# EAGLE design shadokmotion (EAGLE 9.5.2)
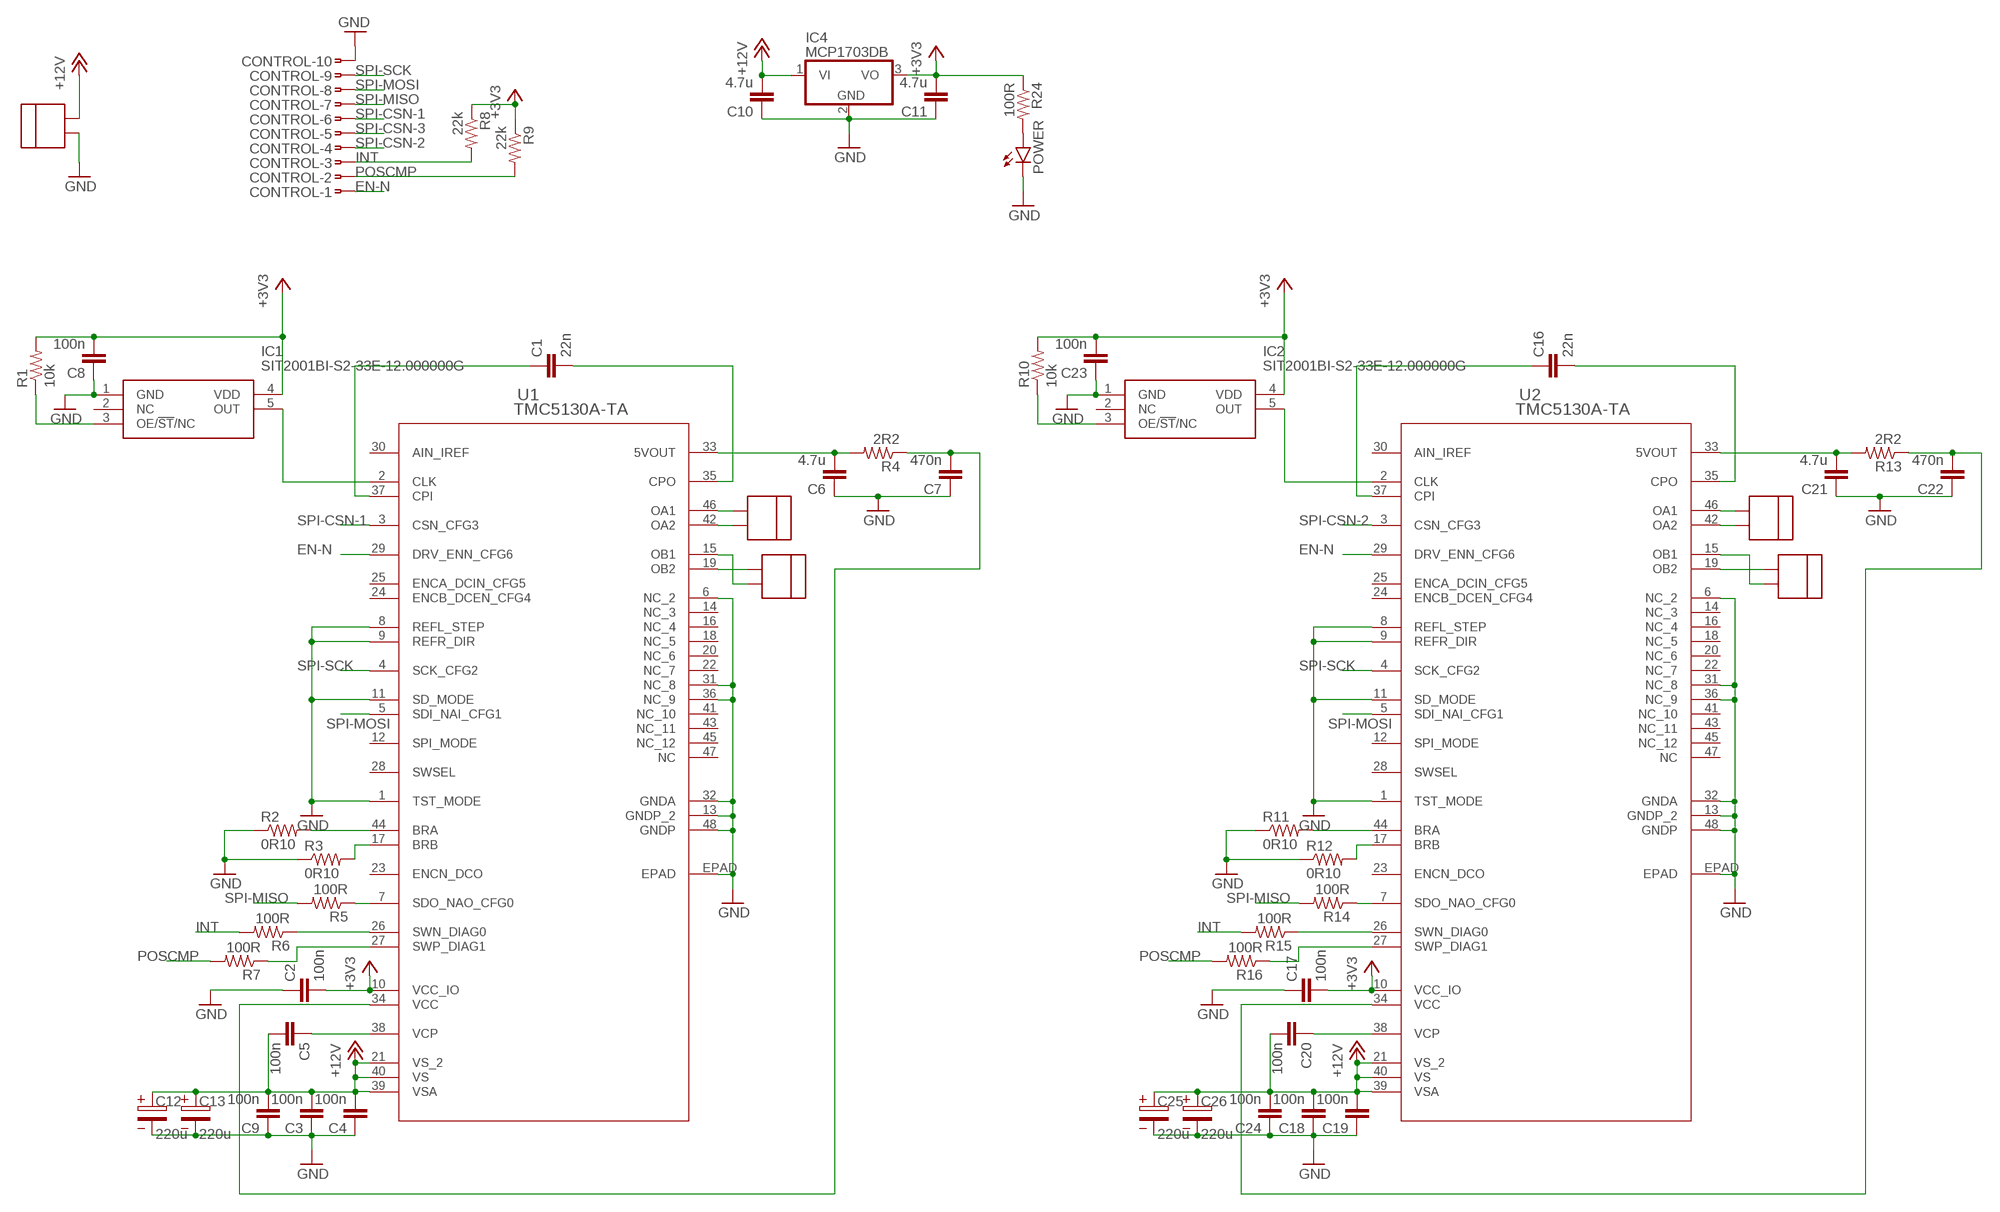
[diagram p0: schematic, sheet 1, part 1 of 2]
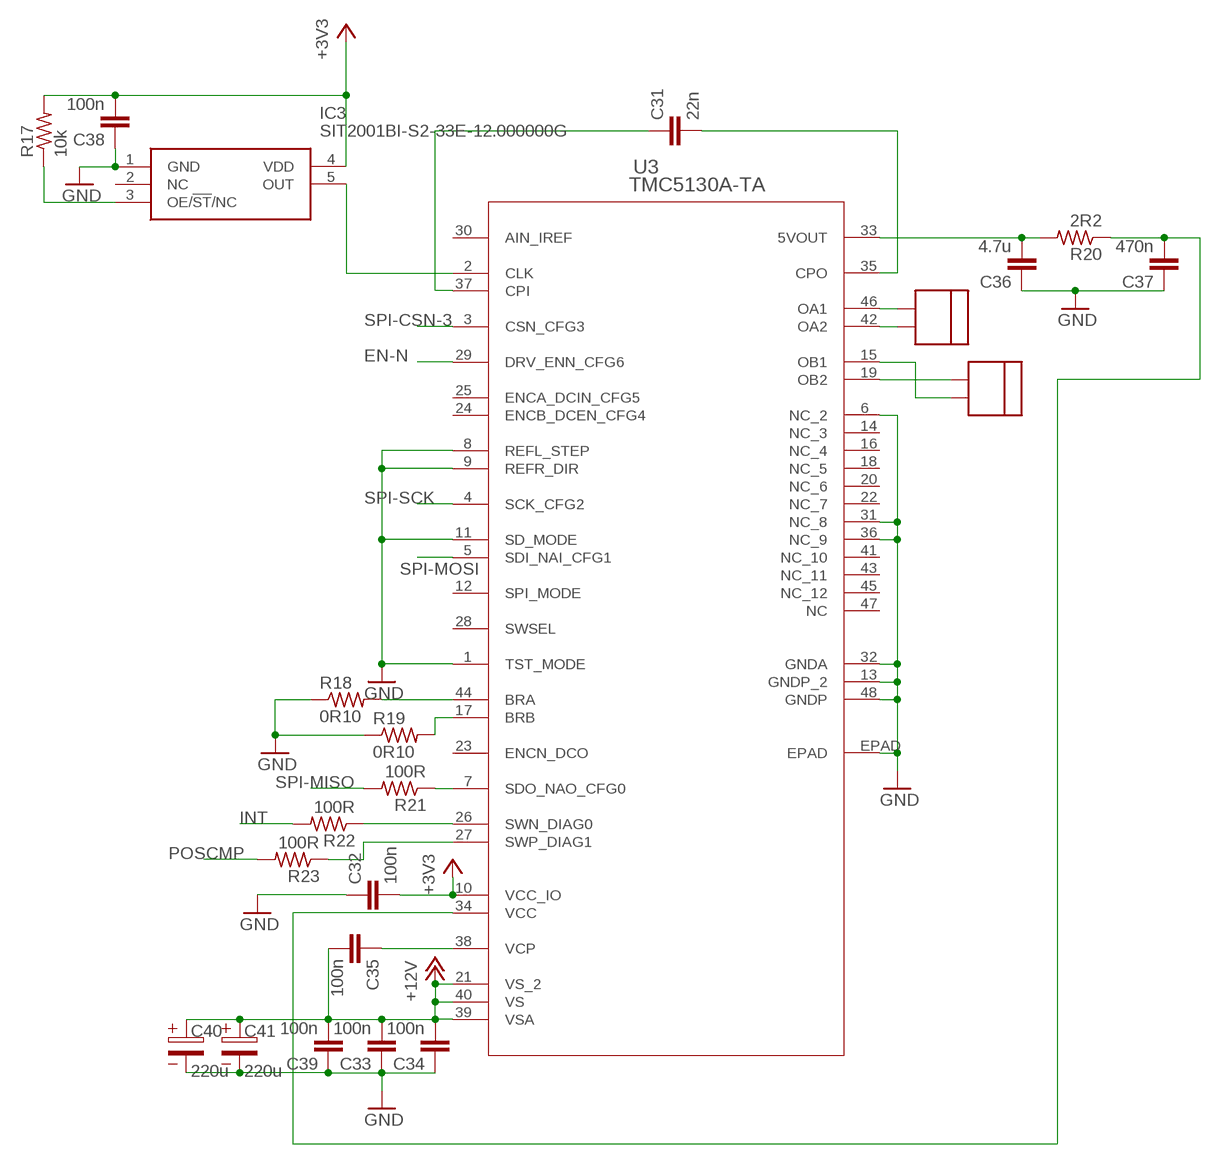
[diagram p1: schematic, sheet 1, part 2 of 2]

## Parts
C1  22n  C-EUC0805  [C0805]
C2  100n  C-EUC0805  [C0805]
C3  100n  C-EUC0805  [C0805]
C4  100n  C-EUC0805  [C0805]
C5  100n  C-EUC0805  [C0805]
C6  4.7u  C-EUC0805  [C0805]
C7  470n  C-EUC0805  [C0805]
C8  100n  C-EUC0805  [C0805]
C9  100n  C-EUC0805  [C0805]
C10  4.7u  C-EUC0805  [C0805]
C11  4.7u  C-EUC0805  [C0805]
C12  220u  WCAP-PSLC_10X12,4_875075561005  [4.4X1.9X4.3(BXCXA)]
C13  220u  WCAP-PSLC_10X12,4_875075561005  [4.4X1.9X4.3(BXCXA)]
C16  22n  C-EUC0805  [C0805]
C17  100n  C-EUC0805  [C0805]
C18  100n  C-EUC0805  [C0805]
C19  100n  C-EUC0805  [C0805]
C20  100n  C-EUC0805  [C0805]
C21  4.7u  C-EUC0805  [C0805]
C22  470n  C-EUC0805  [C0805]
C23  100n  C-EUC0805  [C0805]
C24  100n  C-EUC0805  [C0805]
C25  220u  WCAP-PSLC_10X12,4_875075561005  [4.4X1.9X4.3(BXCXA)]
C26  220u  WCAP-PSLC_10X12,4_875075561005  [4.4X1.9X4.3(BXCXA)]
C31  22n  C-EUC0805  [C0805]
C32  100n  C-EUC0805  [C0805]
C33  100n  C-EUC0805  [C0805]
C34  100n  C-EUC0805  [C0805]
C35  100n  C-EUC0805  [C0805]
C36  4.7u  C-EUC0805  [C0805]
C37  470n  C-EUC0805  [C0805]
C38  100n  C-EUC0805  [C0805]
C39  100n  C-EUC0805  [C0805]
C40  220u  WCAP-PSLC_10X12,4_875075561005  [4.4X1.9X4.3(BXCXA)]
C41  220u  WCAP-PSLC_10X12,4_875075561005  [4.4X1.9X4.3(BXCXA)]
CONTROL  SMDTOP-10  [SMDTOP10]
IC1  SIT2001BI-S2-33E-12.000000G  [SOT95P280X130-5N]
IC2  SIT2001BI-S2-33E-12.000000G  [SOT95P280X130-5N]
IC3  SIT2001BI-S2-33E-12.000000G  [SOT95P280X130-5N]
IC4  MCP1703DB  [SOT223]
M1-A  CTB5202/2  [CTB5202/2]
M1-A1  CTB5202/2  [CTB5202/2]
M1-A2  CTB5202/2  [CTB5202/2]
M1-B  CTB5202/2  [CTB5202/2]
M1-B1  CTB5202/2  [CTB5202/2]
M1-B2  CTB5202/2  [CTB5202/2]
POWER  LEDCHIPLED_0805  [CHIPLED_0805]
R1  10k  R-US_R0805  [R0805]
R2  0R10  R-US_R1206  [R1206]
R3  0R10  R-US_R1206  [R1206]
R4  2R2  R-US_R0805  [R0805]
R5  100R  R-US_R0805  [R0805]
R6  100R  R-US_R0805  [R0805]
R7  100R  R-US_R0805  [R0805]
R8  22k  R-US_R0805  [R0805]
R9  22k  R-US_R0805  [R0805]
R10  10k  R-US_R0805  [R0805]
R11  0R10  R-US_R1206  [R1206]
R12  0R10  R-US_R1206  [R1206]
R13  2R2  R-US_R0805  [R0805]
R14  100R  R-US_R0805  [R0805]
R15  100R  R-US_R0805  [R0805]
R16  100R  R-US_R0805  [R0805]
R17  10k  R-US_R0805  [R0805]
R18  0R10  R-US_R1206  [R1206]
R19  0R10  R-US_R1206  [R1206]
R20  2R2  R-US_R0805  [R0805]
R21  100R  R-US_R0805  [R0805]
R22  100R  R-US_R0805  [R0805]
R23  100R  R-US_R0805  [R0805]
R24  100R  R-US_R0805  [R0805]
U1  TMC5130A-TA  [ETQFP48_9X9]
U2  TMC5130A-TA  [ETQFP48_9X9]
U3  TMC5130A-TA  [ETQFP48_9X9]
U$3  CTB5202/2  [CTB5202/2]

## Nets
+3V3: C2.2 C8.2 C11.2 C17.2 C23.2 C32.2 C38.2 IC1.4(VDD) IC2.4(VDD) IC3.4(VDD) IC4.3(VO) R1.2 R8.1 R9.1 R10.2 R17.2 R24.1 U1.10(VCC_IO) U2.10(VCC_IO) U3.10(VCC_IO)
+12V: C3.2 C4.2 C5.2 C9.2 C10.2 C12.1 C13.1 C18.2 C19.2 C20.2 C24.2 C25.1 C26.1 C33.2 C34.2 C35.2 C39.2 C40.1 C41.1 IC4.1(VI) U1.21(VS_2) U1.39(VSA) U1.40(VS) U2.21(VS_2) U2.39(VSA) U2.40(VS) U3.21(VS_2) U3.39(VSA) U3.40(VS) U$3.P$2
EN-N: CONTROL.1 U1.29(DRV_ENN_CFG6) U2.29(DRV_ENN_CFG6) U3.29(DRV_ENN_CFG6)
GND: C2.1 C3.1 C4.1 C6.1 C7.1 C8.1 C9.1 C10.1 C11.1 C12.2 C13.2 C17.1 C18.1 C19.1 C21.1 C22.1 C23.1 C24.1 C25.2 C26.2 C32.1 C33.1 C34.1 C36.1 C37.1 C38.1 C39.1 C40.2 C41.2 CONTROL.10 IC1.1(GND) IC2.1(GND) IC3.1(GND) IC4.2(GND) POWER.C R2.1 R3.1 R11.1 R12.1 R18.1 R19.1 U1.1(TST_MODE) U1.6(NC_2) U1.8(REFL_STEP) U1.9(REFR_DIR) U1.11(SD_MODE) U1.13(GNDP_2) U1.31(NC_8) U1.32(GNDA) U1.36(NC_9) U1.48(GNDP) U1.EPAD U2.1(TST_MODE) U2.6(NC_2) U2.8(REFL_STEP) U2.9(REFR_DIR) U2.11(SD_MODE) U2.13(GNDP_2) U2.31(NC_8) U2.32(GNDA) U2.36(NC_9) U2.48(GNDP) U2.EPAD U3.1(TST_MODE) U3.6(NC_2) U3.8(REFL_STEP) U3.9(REFR_DIR) U3.11(SD_MODE) U3.13(GNDP_2) U3.31(NC_8) U3.32(GNDA) U3.36(NC_9) U3.48(GNDP) U3.EPAD U$3.P$1
INT: CONTROL.3 R6.2 R8.2 R15.2 R22.2
N$1: C1.1 U1.37(CPI)
N$2: C1.2 U1.35(CPO)
N$3: IC1.5(OUT) U1.2(CLK)
N$4: IC1.3(OE/!ST!/NC) R1.1
N$5: M1-A.P$1 U1.46(OA1)
N$6: M1-A.P$2 U1.42(OA2)
N$7: M1-B.P$1 U1.19(OB2)
N$8: M1-B.P$2 U1.15(OB1)
N$9: C5.1 U1.38(VCP)
N$10: R2.2 U1.44(BRA)
N$11: R3.2 U1.17(BRB)
N$12: C6.2 R4.2 U1.33(5VOUT)
N$13: R7.1 U1.27(SWP_DIAG1)
N$14: C7.2 R4.1 U1.34(VCC)
N$15: R6.1 U1.26(SWN_DIAG0)
N$16: R5.1 U1.7(SDO_NAO_CFG0)
N$17: C16.1 U2.37(CPI)
N$18: C16.2 U2.35(CPO)
N$19: IC2.5(OUT) U2.2(CLK)
N$20: IC2.3(OE/!ST!/NC) R10.1
N$21: M1-A1.P$1 U2.46(OA1)
N$22: M1-A1.P$2 U2.42(OA2)
N$23: M1-B1.P$1 U2.19(OB2)
N$24: M1-B1.P$2 U2.15(OB1)
N$25: C20.1 U2.38(VCP)
N$26: R11.2 U2.44(BRA)
N$27: R12.2 U2.17(BRB)
N$28: C21.2 R13.2 U2.33(5VOUT)
N$29: C22.2 R13.1 U2.34(VCC)
N$30: R15.1 U2.26(SWN_DIAG0)
N$31: R14.1 U2.7(SDO_NAO_CFG0)
N$32: R16.1 U2.27(SWP_DIAG1)
N$33: C31.1 U3.37(CPI)
N$34: C31.2 U3.35(CPO)
N$35: IC3.5(OUT) U3.2(CLK)
N$36: IC3.3(OE/!ST!/NC) R17.1
N$37: M1-A2.P$1 U3.46(OA1)
N$38: M1-A2.P$2 U3.42(OA2)
N$39: M1-B2.P$1 U3.19(OB2)
N$40: M1-B2.P$2 U3.15(OB1)
N$41: C35.1 U3.38(VCP)
N$42: R18.2 U3.44(BRA)
N$43: R19.2 U3.17(BRB)
N$44: C36.2 R20.2 U3.33(5VOUT)
N$45: C37.2 R20.1 U3.34(VCC)
N$46: R22.1 U3.26(SWN_DIAG0)
N$47: R21.1 U3.7(SDO_NAO_CFG0)
N$48: R23.1 U3.27(SWP_DIAG1)
N$49: POWER.A R24.2
POSCMP: CONTROL.2 R7.2 R9.2 R16.2 R23.2
SPI-CSN-1: CONTROL.6 U1.3(CSN_CFG3)
SPI-CSN-2: CONTROL.4 U2.3(CSN_CFG3)
SPI-CSN-3: CONTROL.5 U3.3(CSN_CFG3)
SPI-MISO: CONTROL.7 R5.2 R14.2 R21.2
SPI-MOSI: CONTROL.8 U1.5(SDI_NAI_CFG1) U2.5(SDI_NAI_CFG1) U3.5(SDI_NAI_CFG1)
SPI-SCK: CONTROL.9 U1.4(SCK_CFG2) U2.4(SCK_CFG2) U3.4(SCK_CFG2)
Unconnected: IC1.2(NC) IC2.2(NC) IC3.2(NC) U1.12(SPI_MODE) U1.14(NC_3) U1.16(NC_4) U1.18(NC_5) U1.20(NC_6) U1.22(NC_7) U1.23(ENCN_DCO) U1.24(ENCB_DCEN_CFG4) U1.25(ENCA_DCIN_CFG5) U1.28(SWSEL) U1.30(AIN_IREF) U1.41(NC_10) U1.43(NC_11) U1.45(NC_12) U1.47(NC) U2.12(SPI_MODE) U2.14(NC_3) U2.16(NC_4) U2.18(NC_5) U2.20(NC_6) U2.22(NC_7) U2.23(ENCN_DCO) U2.24(ENCB_DCEN_CFG4) U2.25(ENCA_DCIN_CFG5) U2.28(SWSEL) U2.30(AIN_IREF) U2.41(NC_10) U2.43(NC_11) U2.45(NC_12) U2.47(NC) U3.12(SPI_MODE) U3.14(NC_3) U3.16(NC_4) U3.18(NC_5) U3.20(NC_6) U3.22(NC_7) U3.23(ENCN_DCO) U3.24(ENCB_DCEN_CFG4) U3.25(ENCA_DCIN_CFG5) U3.28(SWSEL) U3.30(AIN_IREF) U3.41(NC_10) U3.43(NC_11) U3.45(NC_12) U3.47(NC)

## Library data of the parts
C1-C11 C16-C24 C31-C39 = rcl:C-EU: CAPACITOR, European symbol; SPICEPREFIX: C
C12 C13 C25 C26 C40 C41 = Wurth_Elektronik_Passive_Capacitors_rev19a:WCAP-PSLC: WCAP-PSLC Aluminum Polymer Capacitors Characteristics Alumnium Polymer Capacitor Recommended soldering: Reflow Operating temperature: -55 °C to +105 °C Large capacitance SMD product series Very low ESR at high frequency range High permissible ripple current Long life and high reliability Load life:2000 h @ +105 °C Package name and Variant abbreviation: Package: Package: B X C X A = length of the solder pad X width of the solder pad X pitch of the solder pad. Variant: D X L = Diameter of the body part X Height of the body part. <http://katalog.we-online.de/media/images/eisos/WCAP-PSLC_pf2.jpg> Details see: http://katalog.we-online.de/en/pbs/WCAP-PSLC?m Created: 2015-03-10 2015 (C) Wurth Elektronik; WE-NUMBER: 875075561005/100uF
CONTROL = con-amp:SMDTOP-10: AMP connector
IC1-IC3 = SIT2001BI-S2-33E-12.000000G:SIT2001BI-S2-33E-12.000000G: SITIME - SIT2001BI-S2-33E-12.000000G - CLOCK GENERATOR, 1-O/P, 12MHZ, SOT-23-5 Source: Datasheet <https://www.sitime.com/api/gated/SiT2001B-datasheet.pdf>; DESCRIPTION: SITIME - SIT2001BI-S2-33E-12.000000G - CLOCK GENERATOR, 1-O/P, 12MHZ, SOT-23-5; HEIGHT: 1.3mm; MANUFACTURER_NAME: SiTime; MANUFACTURER_PART_NUMBER: SIT2001BI-S2-33E-12.000000G; MOUSER_PART_NUMBER: 788-2001BIS233E120G; MOUSER_PRICE-STOCK: https://www.mouser.com/Search/Refine.aspx?Keyword=788-2001BIS233E120G
IC4 = linear:MCP1703: 250 mA, 16V, Low Quiescent Current LDO Regulator Source: http://ww1.microchip.com/downloads/en/DeviceDoc/22049b.pdf
M1-A M1-A1 M1-A2 M1-B M1-B1 M1-B2 U$3 = CTB5202:CTB5202/2
POWER = led:LED: LED OSRAM: - CHIPLED LG R971, LG N971, LY N971, LG Q971, LY Q971, LO R971, LY R971 LH N974, LH R974 LS Q976, LO Q976, LY Q976 LO Q996 - Hyper CHIPLED LW Q18S LB Q993, LB Q99A, LB R99A - SideLED LS A670, LO A670, LY A670, LG A670, LP A670 LB A673, LV A673, LT A673, LW A673 LH A674 LY A675 LS A676, LA A676, LO A676, LY A676, LW A676 LS A679, LY A679, LG A679 - Hyper Micro SIDELED® LS Y876, LA Y876, LO Y876, LY Y876 LT Y87S - SmartLED LW L88C, LW L88S LB L89C, LB L89S, LG L890 LS L89K, LO L89K, LY L89K LS L896, LA L896, LO L896, LY L896 - TOPLED LS T670, LO T670, LY T670, LG T670, LP T670 LSG T670, LSP T670, LSY T670, LOP T670, LYG T670 LG T671, LOG T671, LSG T671 LB T673, LV T673, LT T673, LW T673 LH T674 LS T676, LA T676, LO T676, LY T676, LB T676, LH T676, LSB T676, LW T676 LB T67C, LV T67C, LT T67C, LS T67K, LO T67K, LY T67K, LW E67C LS E67B, LA E67B, LO E67B, LY E67B, LB E67C, LV E67C, LT E67C LW T67C LS T679, LY T679, LG T679 LS T770, LO T770, LY T770, LG T770, LP T770 LB T773, LV T773, LT T773, LW T773 LH T774 LS E675, LA E675, LY E675, LS T675 LS T776, LA T776, LO T776, LY T776, LB T776 LHGB T686 LT T68C, LB T68C - Hyper Mini TOPLED® LB M676 - Mini TOPLED Santana® LG M470 LS M47K, LO M47K, LY M47K Source: http://www.osram.convergy.de LUXEON: - LUMILED® LXK2-PW12-R00, LXK2-PW12-S00, LXK2-PW14-U00, LXK2-PW14-V00 LXK2-PM12-R00, LXK2-PM12-S00, LXK2-PM14-U00 LXK2-PE12-Q00, LXK2-PE12-R00, LXK2-PE12-S00, LXK2-PE14-T00, LXK2-PE14-U00 LXK2-PB12-K00, LXK2-PB12-L00, LXK2-PB12-M00, LXK2-PB14-N00, LXK2-PB14-P00, LXK2-PB14-Q00 LXK2-PR12-L00, LXK2-PR12-M00, LXK2-PR14-Q00, LXK2-PR14-R00 LXK2-PD12-Q00, LXK2-PD12-R00, LXK2-PD12-S00 LXK2-PH12-R00, LXK2-PH12-S00 LXK2-PL12-P00, LXK2-PL12-Q00, LXK2-PL12-R00 Source: www.luxeon.com KINGBRIGHT: KA-3528ASYC Source: www.kingbright.com
R1-R24 = rcl:R-US_: RESISTOR, American symbol; SPICEPREFIX: R
U1-U3 = Trinamic:TMC5130A-TA; BUILT_BY: EMA_Jessica; COPYRIGHT: Copyright (C) 2016 Accelerated Designs. All rights reserved; MANUFACTURER_PART_NUMBER: TMC5130A-TA; VENDOR: TRINAMIC

## Board
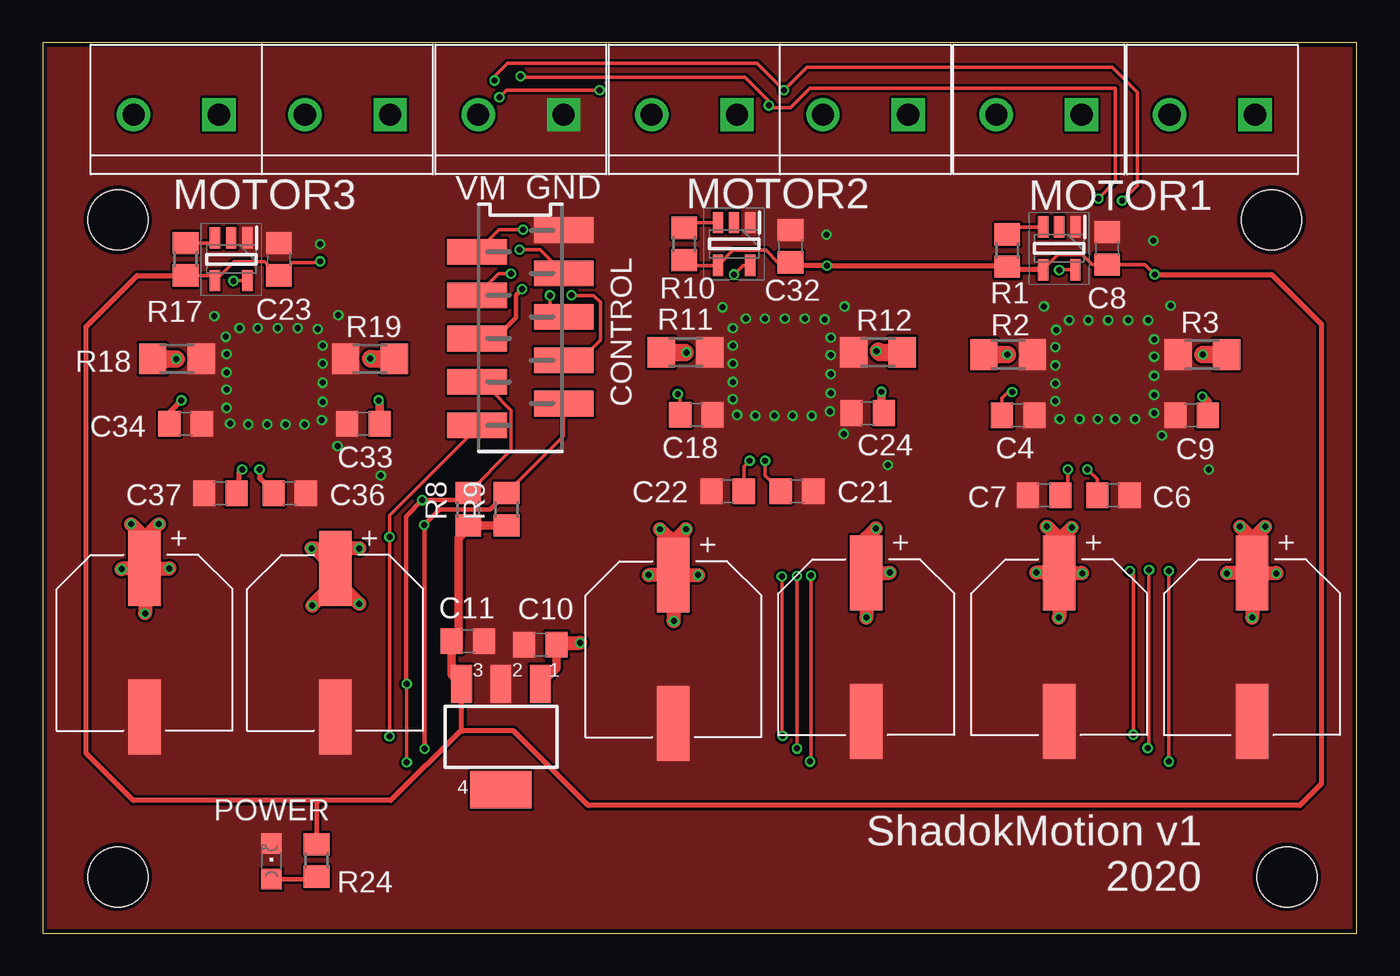
[diagram p2: board, top side]
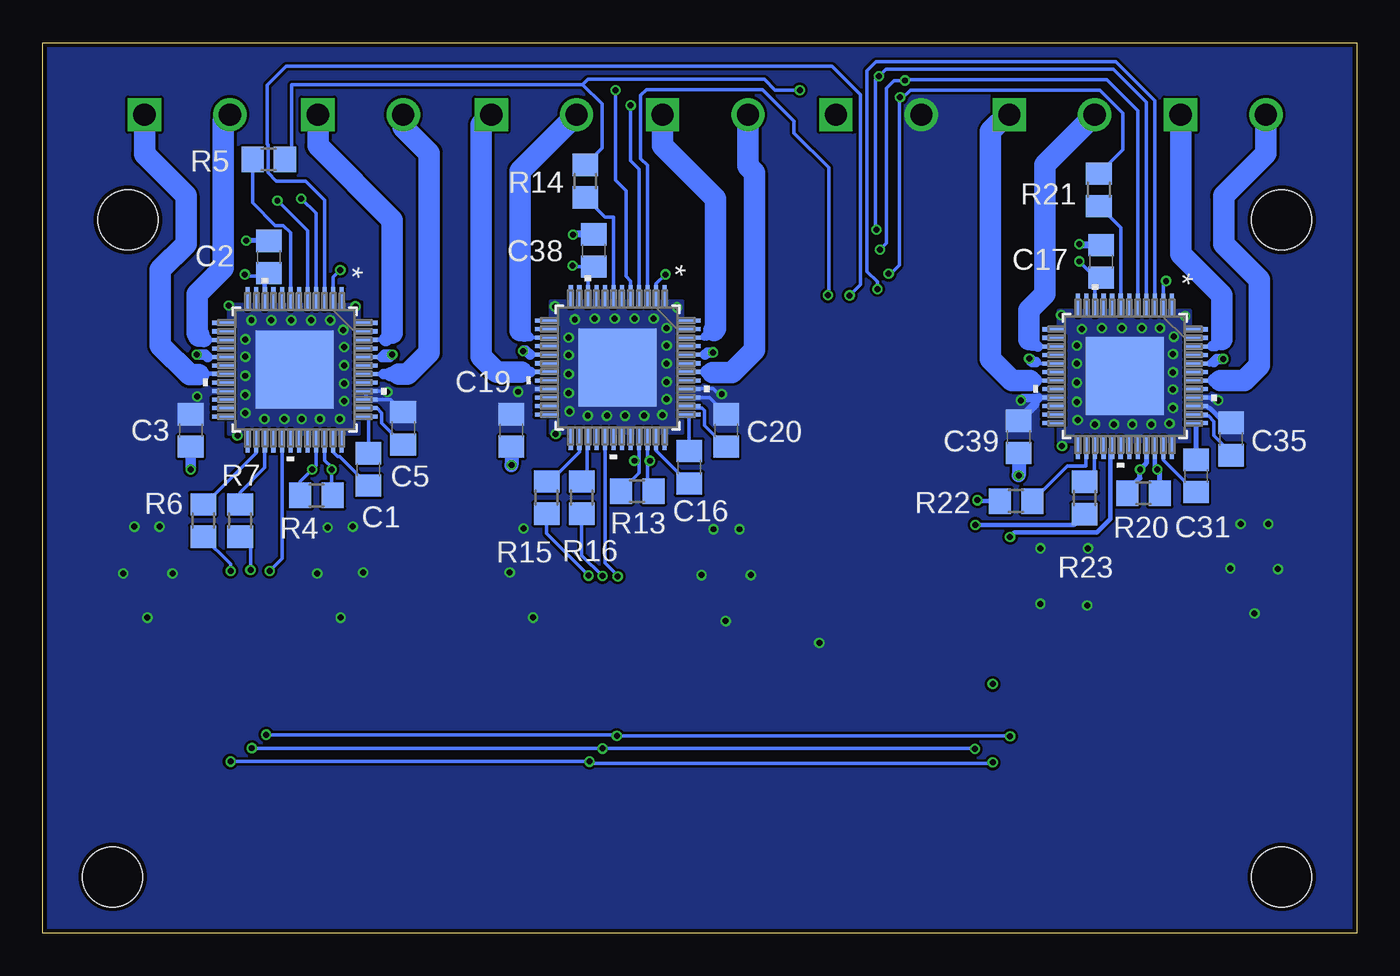
[diagram p3: board, bottom side, seen from below]

Size 77 x 52.19 mm. Coordinates in mm from the lower left corner, seen from the top.
Outline: 0,0 77,0 77,52.19 0,52.19 0,0
Copper layers (1*16): Top 0.018mm / dielectric 1.55mm / Bottom 0.018mm
Design rules "eurocircuit": minimum track width 0.15mm, minimum drill 0.35mm, track to track 0.15mm, track to pad 0.15mm, pad to pad 0.15mm, via to via 0.15mm, smd to smd 0mil, copper to edge 0.25mm, drill to drill 0.35mm, minimum pad ring 0.175mm, minimum via ring 0.125mm, stop-mask expansion 0mil, vias tented up to drill 0.45mm, thermal gap 0.2mm
Holes 3.5 mm at 4.4,3.3 72.9,3.3 4.4,41.8 72,41.8
tKeepout: area 1.7,39 to 7.2,44.5

### Footprints (pad centres in the part's own frame; a part is rotated, then mirrored left to right if it is on the bottom)
C0805 = smd 1.3 x 1.5: 1 -0.95,0; 2 0.95,0
4.4X1.9X4.3(BXCXA) = smd 4.4 x 1.9: 1 4.35,0; 2 -4.35,0
SMDTOP10 = smd 1.5 x 3.5: 1 -5.715,2.54; 2 -4.445,-2.54; 3 -3.175,2.54; 4 -1.905,-2.54; 5 -0.635,2.54; 6 0.635,-2.54; 7 1.905,2.54; 8 3.175,-2.54; 9 4.445,2.54; 10 5.715,-2.54
SOT95P280X130-5N = smd 1.25 x 0.6: 1 -1.25,0.95; 2 -1.25,0; 3 -1.25,-0.95; 4 1.25,-0.95; 5 1.25,0.95
SOT223 = smd 1.219 x 2.235: 1 -2.311,-3.099; 2 0,-3.099; 3 2.311,-3.099 | smd 3.6 x 2.2: 4 0,3.099
CTB5202/2 = drill 1.3 square: P$1 2.5,4.1 | drill 1.3: P$2 7.5,4.1
CHIPLED_0805 = smd 1.2 x 1.2: A 0,-1.05; C 0,1.05
R0805 = smd 1.3 x 1.5: 1 -0.95,0; 2 0.95,0
R1206 = smd 1.6 x 1.803: 1 -1.422,0; 2 1.422,0
ETQFP48_9X9 = smd 1.341 x 0.239: 1 -4.176,2.75; 2 -4.176,2.25; 3 -4.176,1.75; 4 -4.176,1.25; 5 -4.176,0.75; 6 -4.176,0.25; 7 -4.176,-0.25; 8 -4.176,-0.75; 9 -4.176,-1.25; 10 -4.176,-1.75; 11 -4.176,-2.25; 12 -4.176,-2.75; 25 4.176,-2.75; 26 4.176,-2.25; 27 4.176,-1.75; 28 4.176,-1.25; 29 4.176,-0.75; 30 4.176,-0.25; 31 4.176,0.25; 32 4.176,0.75; 33 4.176,1.25; 34 4.176,1.75; 35 4.176,2.25; 36 4.176,2.75 | smd 0.239 x 1.341: 13 -2.75,-4.176; 14 -2.25,-4.176; 15 -1.75,-4.176; 16 -1.25,-4.176; 17 -0.75,-4.176; 18 -0.25,-4.176; 19 0.25,-4.176; 20 0.75,-4.176; 21 1.25,-4.176; 22 1.75,-4.176; 23 2.25,-4.176; 24 2.75,-4.176; 37 2.75,4.176; 38 2.25,4.176; 39 1.75,4.176; 40 1.25,4.176; 41 0.75,4.176; 42 0.25,4.176; 43 -0.25,4.176; 44 -0.75,4.176; 45 -1.25,4.176; 46 -1.75,4.176; 47 -2.25,4.176; 48 -2.75,4.176 | smd 4.572 x 4.572: EPAD 0,0

### Placement (x,y rotation side)
C1  57.91,27.18 270 bottom
C2  63.75,39.62 270 bottom
C3  68.33,29.46 90 bottom
C4  57.15,30.35 180 top
C5  55.88,29.59 90 bottom
C6  62.74,25.65 180 top
C7  58.67,25.65 0 top
C8  62.36,40.13 270 top
C9  67.31,30.35 0 top
C10  29.16,16.92 0 top
C11  24.92,17.12 180 top
C12  17.14,17.02 90 top
C13  5.97,17.02 90 top
C16  39.12,27.3 270 bottom
C17  14.99,39.37 270 bottom
C18  38.3,30.38 180 top
C19  49.53,29.46 90 bottom
C20  36.96,29.46 90 bottom
C21  44.2,25.91 180 top
C22  40.13,25.91 0 top
C23  13.84,39.5 270 top
C24  48.34,30.48 0 top
C25  48.26,16.76 90 top
C26  59.56,16.76 90 top
C31  9.42,26.8 270 bottom
C32  43.81,40.26 270 top
C33  18.8,29.84 0 top
C34  8.38,29.84 180 top
C35  7.37,28.96 90 bottom
C36  14.48,25.78 180 top
C37  10.41,25.78 0 top
C38  44.7,40.01 270 bottom
C39  19.81,29.08 90 bottom
C40  70.87,16.76 90 top
C41  36.96,16.64 90 top
CONTROL  27.99,35.48 90 top
IC1  59.56,40.13 270 top
IC2  40.51,40.39 270 top
IC3  11.05,39.5 270 top
IC4  26.85,11.51 180 top
M1-A  63.37,52.07 180 top
M1-A1  43.18,52.07 180 top
M1-A2  12.83,52.07 180 top
M1-B  73.53,52.07 180 top
M1-B1  53.21,52.07 180 top
M1-B2  22.86,52.07 180 top
POWER  13.41,4.22 0 top
R1  56.52,40.01 270 top
R2  56.57,33.91 180 top
R3  67.94,33.91 0 top
R4  60.96,25.65 180 bottom
R5  63.75,45.34 0 bottom
R6  67.59,24.18 270 bottom
R7  65.43,24.18 270 bottom
R8  24.94,24.84 90 top
R9  27.18,24.84 90 top
R10  37.59,40.39 270 top
R11  37.67,34.04 180 top
R12  48.95,34.04 0 top
R13  42.16,25.91 180 bottom
R14  45.21,44.07 90 bottom
R15  47.47,25.53 270 bottom
R16  45.42,25.53 270 bottom
R17  8.38,39.5 270 top
R18  7.87,33.66 180 top
R19  19.18,33.66 0 top
R20  12.5,25.78 180 bottom
R21  15.11,43.56 90 bottom
R22  19.96,25.32 180 bottom
R23  15.95,25.5 270 bottom
R24  16.05,4.27 270 top
U1  62.23,33.02 270 bottom
U2  43.31,33.15 270 bottom
U3  13.59,32.64 270 bottom
U$3  33.02,52.07 180 top

### Tracks (layer width: path | path; a pad name or v marks a point on that pad's centre or on a via)
+3V3  (via drill 0.35)
  Top 0.203: IC1.4 59.49,39.76 60.92,39.76 61.5,39.18 C8.2 64.58,39.18 v65.15,38.61 | R17.2 8.51,38.55 9.8,38.55 IC3.4 11.22,39.37 13.02,39.37 C23.2 14.61,39.31 16.2,39.31 v16.26,39.37 | C32.2 43.08,39.31 42.38,40.02 40.44,40.02 IC2.4 37.89,39.14 R10.2
  Top 0.254: R24.1 16.05,7.62 16.2,7.77
  Top 0.305: 24.54,11.91 20.4,7.77 16.2,7.77 5.31,7.77 2.54,10.54 2.54,35.56 5.53,38.55 8.51,38.55 | v65.15,38.61 72.01,38.61 74.93,35.69 74.93,8.76 73.66,7.49 31.96,7.49 27.61,11.84 24.61,11.84 24.54,11.91 | 24.54,11.91 IC4.3 | C32.2 44.01,39.12 v45.95,39.12 56.45,39.12 R1.2 56.69,38.88 IC1.4
  Top 0.508: IC4.3 23.97,15.17 C11.2 24.37,17.53 24.37,23.17 24.94,23.74 R8.1 R9.1
  Bottom 0.203: v65.15,38.61 65.06,38.51 63.91,38.51 | v16.26,39.37 15.31,38.42 C17.2 15.34,38.07 U3.10 | v45.95,39.12 45.89,39.05 C38.2 45.06,38.7 U2.10
  Bottom 0.254: U1.10 63.98,38.45 63.91,38.51 C2.2
+12V  (via drill 0.35)
  Top 0.203: v37.21,31.6 37.35,31.46 C18.2 | C4.2 56.2,31.36 56.56,31.72 v56.81,31.72
  Top 0.305: C34.2 7.43,30.53 v8.13,31.22
  Top 0.508: C24.2 49.15,30.62 v49.15,31.73 | v67.94,31.45 68.26,31.14 C9.2 | IC4.1 30.11,15.55 C10.2 | v19.68,31.22 19.75,31.16 C33.2
  Top 0.813: v58.83,23.82 59.56,23.09 59.56,23.04 | C26.1 59.56,23.04 | 59.56,23.04 v60.3,23.77 | C26.1 60.88,21.11 v60.91,21.08 | C26.1 59.1,21.11 59.08,21.13 v58.22,21.13 | C26.1 59.56,18.52 v59.54,18.49 | C40.1 69.42,21.11 v69.39,21.08 | C40.1 72.26,21.11 v72.29,21.08 | C40.1 70.87,23.06 v71.63,23.82 | C40.1 70.87,23.11 v70.16,23.82 | C25.1 48.26,23.16 v48.82,23.72 | C25.1 49.61,21.11 v49.63,21.13 | C25.1 v48.26,18.49 | v37.69,23.67 36.96,22.94 36.96,22.89 | C41.1 v38.4,20.99 v38.41,20.98 | C41.1 v35.52,20.99 v35.51,20.98 | C41.1 36.96,18.31 v36.98,18.29 | C41.1 36.96,22.89 | 36.96,22.89 v36.17,23.67 | C12.1 17.14,20.7 v18.54,19.3 | C12.1 17.14,22.54 18.52,22.54 v18.54,22.55 | C12.1 15.96,22.55 v15.75,22.55 | C13.1 4.66,21.37 v4.62,21.34 | C13.1 7.4,21.37 v7.42,21.39 | C13.1 5.99,21.34 v5.99,18.75 | C13.1 5.97,23.19 v5.18,23.98 | C13.1 5.97,23.14 v6.81,23.98 | C10.2 30.21,17.02 v31.5,17.02 | C12.1 17.14,20.55 v15.8,19.2 | C40.1 v70.87,18.49
  Bottom 0.203: C20.2 37.94,31.4 U2.39 | v37.21,31.6 37.41,31.6 37.72,31.91 U2.40 | U3.21 19.52,31.39 v19.68,31.22 | C5.2 56.61,31.27 U1.39 U1.40 56.86,31.77 v56.81,31.72
  Bottom 0.254: v8.13,31.22 8.41,31.22 8.59,31.39 U3.40 | U3.39 8.79,30.89 8.69,30.79 8.63,30.79 7.75,29.91 C35.2
  Bottom 0.508: v19.68,31.22 19.56,31.35 18.74,31.35 18.7,31.39 18.63,31.39 18.84,31.18 18.84,31 C39.2
  pour Bottom (rank 6, no thermals): 0.13,0.13 0.13,52.07 76.96,52.07 76.96,0 0.13,0
EN-N  (via drill 0.35)
  Top 0.203: CONTROL.1 25.45,29.62 20.32,24.49 v20.32,23.22 v20.32,11.53 | v43.31,20.9 43.31,11.56 43.33,11.53 v43.36,11.56 | v63.7,21.23 63.91,21.03 v63.91,11.63
  Bottom 0.203: v63.7,21.23 62.98,21.95 U1.29 | v43.31,20.9 43.28,20.93 44.06,21.7 U2.29 | v20.32,11.53 20.37,11.48 20.45,11.56 v43.36,11.56 43.43,11.63 v63.91,11.63
  Bottom 0.254: U3.29 14.44,28.36 14.44,24.27 15.24,23.47 20.07,23.47 v20.32,23.22
GND  (via drill 0.35)
  Bottom 0.254: 61.72,32.51 U1.EPAD
  Bottom 0.305: C2.1 63.77,40.59 v65.08,40.59
  Bottom 0.406: C38.1 45.91,40.95 v45.92,40.95 | C17.1 16.19,40.32 v16.26,40.39
  Bottom 0.61: C3.1 v68.33,27.18
  Bottom 0.813: C39.1 v19.81,26.82 | C19.1 v49.53,27.43
  other vias: 59.33,33.27 59.33,34.34 59.39,35.36 60.15,35.92 61.26,35.92 62.43,35.92 63.6,35.92 64.77,35.92 65.13,34.8 65.13,33.78 65.13,32.66 65.13,31.55 65.13,30.48 64.01,30.12 62.84,30.12 61.82,30.12 60.76,30.12 59.59,30.12 59.33,31.19 59.33,32.21 40.44,33.38 40.44,34.44 40.44,35.46 41.2,36.02 42.32,36.02 43.48,36.02 44.65,36.02 45.82,35.97 46.18,34.9 46.18,33.88 46.18,32.77 46.18,31.65 46.13,30.58 45.06,30.33 43.94,30.33 42.88,30.33 41.76,30.33 40.69,30.38 40.44,31.29 40.44,32.31 10.77,32.87 10.77,33.93 10.72,34.95 11.53,35.46 12.6,35.46 13.77,35.46 14.94,35.46 16.1,35.41 16.41,34.44 16.41,33.38 16.41,32.26 16.41,31.14 16.36,30.07 15.34,29.82 14.22,29.82 13.16,29.82 12.04,29.82 10.97,29.87 10.77,30.78 10.77,31.85 65.58,29.16 58.67,36.73 66.09,36.78 46.94,29.26 46.99,36.73 39.83,36.68 17.27,28.55 17.32,36.22 10.06,36.17
  pour Bottom (rank 3, no thermals): 58.47,36.83 58.47,29.26 58.57,29.26 66.09,29.26 66.09,29.36 66.09,36.83
  pour Bottom (no thermals): 39.52,36.98 39.52,29.31 47.24,29.31 47.24,37.03 39.57,37.03 39.52,37.03
  pour Bottom (no thermals): 9.75,36.47 9.75,28.8 17.48,28.8 17.48,36.47
  pour Top (no thermals): -0.15,54.41 79.91,54.41 79.91,-2.18 -0.15,-2.18
INT  (via drill 0.35)
  Top 0.203: R8.2 27.45,28.3 27.45,30.62 26.29,31.79 26.29,32.26 26.24,32.31 CONTROL.3 | v44.96,10.06 45.01,10.11 v45.01,20.95 | v21.34,10.01 v21.34,14.61 | v65.99,21.23 v65.99,10.06
  Top 0.254: R8.2 24.53,25.38 v22.23,25.38 21.29,24.43 21.29,14.66 v21.34,14.61
  Bottom 0.203: R15.2 47.47,23.42 v45.01,20.95 | v21.34,10.01 21.34,9.96 44.86,9.96 v44.96,10.06 v65.99,10.06 | R6.2 65.99,21.63 v65.99,21.23
  Bottom 0.254: R22.2 22.23,25.32 22.25,25.35 v22.23,25.38
N$1
  Bottom 0.203: C1.1 57.91,30.13 U1.37
N$2
  Bottom 0.203: C1.2 59.6,27.92 59.7,27.92 59.98,28.2 U1.35
N$3  (via drill 0.35)
  Top 0.203: v59.56,38.86 59.58,38.88 IC1.5
  Bottom 0.203: U1.2 59.98,38.45 v59.56,38.86
N$4
  Top 0.203: R1.1 56.94,41.38 IC1.3
N$5
  Bottom 0.254: 56.9,34.8 58.03,34.8 U1.46
  Bottom 0.813: 56.9,34.8 56.52,35.18
  Bottom 1.27: M1-A.P$1 60.87,46.14 56.52,41.78 56.52,35.18
N$6
  Bottom 0.254: 57.02,32.77 U1.42
  Bottom 0.61: 56.13,32.77 56.64,32.77 57.02,32.77
  Bottom 0.813: 55.63,32.77 56.64,32.77
  Bottom 1.27: M1-A.P$2 55.87,47.24 54.36,45.72 54.36,34.04 55.63,32.77 56.13,32.77
N$7
  Bottom 0.254: U1.19 66.42,32.78 67.79,32.78 67.84,32.73
  Bottom 1.27: M1-B.P$1 71.03,45.64 68.6,43.21 68.6,40.39 70.1,38.89 70.1,34.45 68.39,32.73 67.84,32.73
N$8
  Bottom 0.254: 67.48,34.77 U1.15 | U1.15
  Bottom 0.813: 67.86,35 67.63,34.77 67.48,34.77
  Bottom 1.27: M1-B.P$2 66.42,47.58 66.42,38.99 67.94,37.47 67.94,35.15 67.86,35.07 67.86,35
N$9
  Bottom 0.203: C5.1 57.13,29.89 57.13,30.5 57.41,30.77 U1.38
N$10  (via drill 0.35)
  Top 1.016: R2.2 v56.52,33.91
  Bottom 0.203: 56.66,33.78 U1.44
  Bottom 0.61: v56.52,33.91 56.98,33.91 57.12,33.77 56.67,33.77 56.66,33.78
N$11  (via drill 0.35)
  Top 1.016: R3.2 v67.98,33.91
  Bottom 0.203: 67.34,33.77 U1.17
  Bottom 0.61: v67.98,33.91 67.48,33.91 67.34,33.77
N$12  (via drill 0.35)
  Top 0.203: C6.2 61.79,26.6 v61.21,27.18
  Bottom 0.203: U1.33 60.98,27.41 v61.21,27.18 61.91,26.48 R4.2
N$13
  Bottom 0.203: R7.1 65.43,25.83 63.98,27.28 U1.27
N$14  (via drill 0.35)
  Top 0.203: C7.2 59.81,25.84 59.88,25.84 60.07,26.04 v60.07,27.18
  Bottom 0.203: U1.34 60.48,27.71 60.07,27.3 v60.07,27.18 60.07,25.78 60.01,25.72 R4.1
N$15
  Bottom 0.203: U1.26 64.48,28.15 67.5,25.13 R6.1
N$16
  Bottom 0.203: U1.7 62.48,41.06 62.9,41.48 63.38,41.48 64.7,42.8 R5.1
N$17
  Bottom 0.203: C16.1 39.12,30.38 U2.37
N$18
  Bottom 0.203: C16.2 41.06,28.3 U2.35
N$19  (via drill 0.35)
  Top 0.203: IC2.5 41.04,39.14 v40.51,38.61
  Bottom 0.203: v40.51,38.61 41.06,38.06 U2.2
N$20
  Top 0.203: R10.1 37.89,41.64 IC2.3
N$21
  Bottom 0.254: 37.67,35.31 38.08,34.9 U2.46
  Bottom 0.406: 38.1,34.92 38.23,34.92 38.23,35.01 37.88,35.35 37.67,35.35 38.1,34.92
  Bottom 1.27: M1-A1.P$1 40.68,46.14 37.59,43.05 37.59,35.43 37.67,35.35 37.67,35.31
N$22
  Bottom 0.254: 38.05,32.9 U2.42
  Bottom 0.813: 37.74,32.87 38.02,32.87 38.05,32.9
  Bottom 1.27: M1-A1.P$2 35.68,44.95 35.31,44.58 35.31,34.16 36.6,32.87 37.74,32.87
N$23
  Bottom 0.203: U2.19
  Bottom 0.254: 48.42,32.9 U2.19
  Bottom 0.61: 48.95,32.89 48.42,32.89 48.42,32.9
  Bottom 1.27: M1-B1.P$1 51.31,47.38 51.31,33.78 50.42,32.89 48.95,32.89
N$24
  Bottom 0.203: 48.41,34.9 U2.15
  Bottom 0.406: 48.9,35.05 48.74,34.9 48.41,34.9 48.39,34.92 48.51,35.05 48.77,35.05 48.9,35.05
  Bottom 0.813: 49.02,35.31 48.77,35.05
  Bottom 1.27: M1-B1.P$2 49.02,44.66 49.02,35.31
N$25
  Bottom 0.203: C20.1 38.21,29.76 38.21,30.62 38.36,30.77 39.01,30.77 U2.38
N$26  (via drill 0.35)
  Top 0.203: v37.72,34.04 37.63,34.04
  Top 1.016: 37.63,34.04 R11.2
  Bottom 0.203: 38.2,33.9 U2.44
  Bottom 0.61: v37.72,34.04 38.06,34.04 38.2,33.9
N$27  (via drill 0.35)
  Top 0.406: 48.98,34.12 v48.85,34.12
  Top 1.016: R12.2 49.06,34.04 48.98,34.12
  Bottom 0.203: U2.17 48.45,33.9 48.64,33.9 v48.85,34.12
  Bottom 0.61: v48.85,34.12 48.82,34.15 48.7,34.15 48.45,33.9
N$28  (via drill 0.35)
  Top 0.203: C21.2 42.33,26.82 v42.33,27.69
  Bottom 0.203: U2.33 42.06,27.69 | 42.06,27.69 42.06,26.96 R13.2 | v42.33,27.69 42.06,27.69
N$29  (via drill 0.35)
  Top 0.203: C22.2 41.08,27.34 v41.42,27.69
  Bottom 0.203: U2.34 41.56,27.81 | 41.56,27.81 41.56,26.25 R13.1 | v41.42,27.69 v41.43,27.69 41.56,27.81
N$30
  Bottom 0.203: U2.26 45.56,28.19 47.27,26.48 R15.1
N$31
  Bottom 0.203: U2.7 43.56,41.97 44.06,41.97 R14.1
N$32
  Bottom 0.203: U2.27 45.11,28.92 45.11,26.78 R16.1
N$33
  Bottom 0.305: C31.1 U3.37
N$34
  Bottom 0.203: U3.35 11.34,27.73 9.46,25.85 C31.2
N$35  (via drill 0.35)
  Top 0.203: IC3.5 11.2,38.25 v11.18,38.23
  Bottom 0.203: v11.18,38.23 11.34,38.06 U3.2
N$36
  Top 0.203: R17.1 9.8,40.45 IC3.3
N$37
  Bottom 0.254: 8.46,34.41 8.51,34.36 9.39,34.36 U3.46
  Bottom 0.61: 7.92,34.79 8.3,34.41 8.46,34.41
  Bottom 1.27: M1-A2.P$1 10.33,39.79 7.92,37.39 7.92,34.79
N$38
  Bottom 0.254: 8.33,32.39 U3.42
  Bottom 0.813: 8.01,32.39 8.33,32.39
  Bottom 1.27: M1-A2.P$2 5.33,45.68 7.8,43.21 7.8,40.39 5.71,38.3 5.71,33.27 6.6,32.39 8.01,32.39
N$39
  Bottom 0.203: 18.84,32.39 U3.19
  Bottom 0.813: 19.17,32.39 18.84,32.39
  Bottom 1.27: 19.17,32.39 20.2,32.39 21.46,33.66 21.46,46.99 20.48,47.97 M1-B2.P$1
N$40
  Bottom 0.254: U3.15 18.7,34.39
  Bottom 0.61: 18.98,34.53 18.89,34.44 18.75,34.44 18.7,34.39
  Bottom 0.813: 19.23,34.8 19.23,34.77 18.98,34.53
  Bottom 1.27: M1-B2.P$2 18.29,45.04 18.29,37.47 19.23,36.52 19.23,34.8
N$41
  Bottom 0.203: U3.38 9.32,30.29 8.67,30.29 8.37,29.99 8.37,29.15 7.37,28.15 C35.1
N$42  (via drill 0.35)
  Top 1.016: R18.2 v7.84,33.66
  Bottom 0.203: 8.64,33.4 9.4,33.4 U3.44
  Bottom 0.406: 8.38,33.48 8.46,33.4 8.64,33.4
  Bottom 0.61: v7.84,33.66 8.21,33.66 8.38,33.48
N$43  (via drill 0.35)
  Top 0.203: v19.2,33.67 19.21,33.67
  Top 1.016: R19.2 19.23,33.66 19.21,33.67
  Bottom 0.203: 18.79,33.48 18.62,33.48 18.53,33.39 U3.17
  Bottom 0.61: v19.2,33.67 19.01,33.48 18.79,33.48
N$44  (via drill 0.35)
  Top 0.305: v12.7,27.18 12.7,26.67 13.53,25.84 C36.2
  Bottom 0.305: U3.33 12.34,27.54 v12.7,27.18 12.7,26.67 13.45,25.92 R20.2
N$45  (via drill 0.35)
  Top 0.305: C37.2 11.49,25.91 11.49,26.98 v11.68,27.18
  Bottom 0.254: U3.34 11.84,27.33 v11.68,27.18
  Bottom 0.305: R20.1 11.55,27.04 v11.68,27.18
N$46
  Bottom 0.203: U3.26 15.89,28.41 15.89,27.37 16.97,27.37 R22.1
N$47
  Bottom 0.203: U3.7 13.84,41.34 R21.1
N$48
  Bottom 0.203: R23.1 15.37,26.45 15.37,28.44 U3.27
N$49
  Top 0.254: R24.2 15.9,3.17 POWER.A
POSCMP  (via drill 0.35)
  Top 0.203: R9.2 27.29,25.9 30.53,29.14 CONTROL.2 | v44.2,20.93 v44.2,10.82 | v64.82,21.29 64.82,10.87 64.77,10.82 v64.75,10.85
  Top 0.254: 27.29,25.9 26.2,24.82 23.24,24.82 v22.35,23.93 22.38,23.9 v22.38,10.79
  Bottom 0.203: R16.2 45.41,22.15 v44.2,20.93 | v22.38,10.79 22.4,10.77 22.45,10.82 v44.2,10.82 44.22,10.85 v64.75,10.85 | R7.2 64.82,22.62 v64.82,21.29
  Bottom 0.254: R23.2 16.58,23.93 v22.35,23.93
SPI-CSN-1  (via drill 0.35)
  Top 0.203: v29.72,37.38 29.72,36.52 30.12,36.12 CONTROL.6
  Bottom 0.203: U1.3 60.48,42.96 61.6,44.08 63.3,44.08 63.8,44.58 63.8,46.19 63.86,46.25 63.86,49.7 62.74,50.81 30.75,50.81 29.08,49.15 29.08,38.01 v29.72,37.38
SPI-CSN-2  (via drill 0.35)
  Top 0.203: v30.99,37.39 31,37.37 32.28,37.37 32.69,36.97 32.69,34.76 31.58,33.65 30.6,33.65 CONTROL.4
  Bottom 0.203: U2.3 41.56,45 41.96,45.4 41.96,49.1 41.63,49.43 34.82,49.43 32.97,47.58 32.97,46.89 30.94,44.86 30.94,37.39 v30.99,37.39
SPI-CSN-3  (via drill 0.35)
  Top 0.254: v28.09,37.74 27.73,37.38 27.73,36.07 26.51,34.85 CONTROL.5
  Bottom 0.203: U3.3 11.84,48.8 14.11,51.07 28.18,51.07 28.7,50.55 28.7,38.78 28.09,38.17 v28.09,37.74
SPI-MISO  (via drill 0.35)
  Top 0.203: v27.43,38.65 26.71,38.65 CONTROL.7 | v32.64,49.4 27.18,49.4 v26.76,48.99
  Bottom 0.203: R5.2 62.42,45.72 62.42,49.73 45.36,49.73 | 45.36,49.73 45.05,50.04 34.72,50.04 34.09,49.4 v32.64,49.4 | 45.36,49.73 44.23,48.61 44.23,46 R14.2 | R21.2 13.72,45.91 13.72,48.06 15.05,49.4 26.16,49.4 26.67,48.9 | v27.43,38.65 27.3,38.65 26.94,39.01 26.8,39.16 26.8,48.77 26.67,48.9 | v26.76,48.99 26.67,48.9
SPI-MOSI  (via drill 0.35)
  Top 0.203: v63.25,42.93 64.14,43.81 64.14,49.29 62.69,50.74 44.77,50.74 v43.43,49.4 41.85,50.99 27.24,50.99 26.48,50.23 v26.48,49.97 | CONTROL.8 29.13,40.06 v27.94,40.06
  Bottom 0.203: U1.5 61.48,41.16 v63.25,42.93 | v43.43,49.4 43.43,44.12 42.82,43.51 42.82,38.5 42.55,38.23 42.55,37.33 U2.5 | v27.94,40.06 27.56,40.44 27.56,49.52 27.11,49.97 v26.48,49.97 26.44,50.01 14.65,50.01 12.84,48.2 U3.5
SPI-SCK  (via drill 0.35)
  Top 0.203: v61.85,43.05 62.87,44.07 62.87,49.53 44.96,49.53 43.81,48.39 42.55,48.39 v42.55,48.51 42.55,48.77 41.15,50.16 28.06,50.16 v28,50.22 | v28.14,41.22 26.75,41.22 CONTROL.9
  Bottom 0.203: U1.4 60.98,42.18 v61.85,43.05 | v42.55,48.51 42.55,45.26 42.06,44.77 42.06,44.69 U2.4 | U3.4 12.34,48.71 14.25,50.62 27.6,50.62 v28,50.22 28.19,50.03 28.19,41.22 v28.14,41.22

### Text on the board
tNames: VM | GND | MOTOR3 | MOTOR2 | MOTOR1 | ShadokMotion v1 / 2020